# EAGLE design ESP12_2.9EPaper (EAGLE 9.1.3)
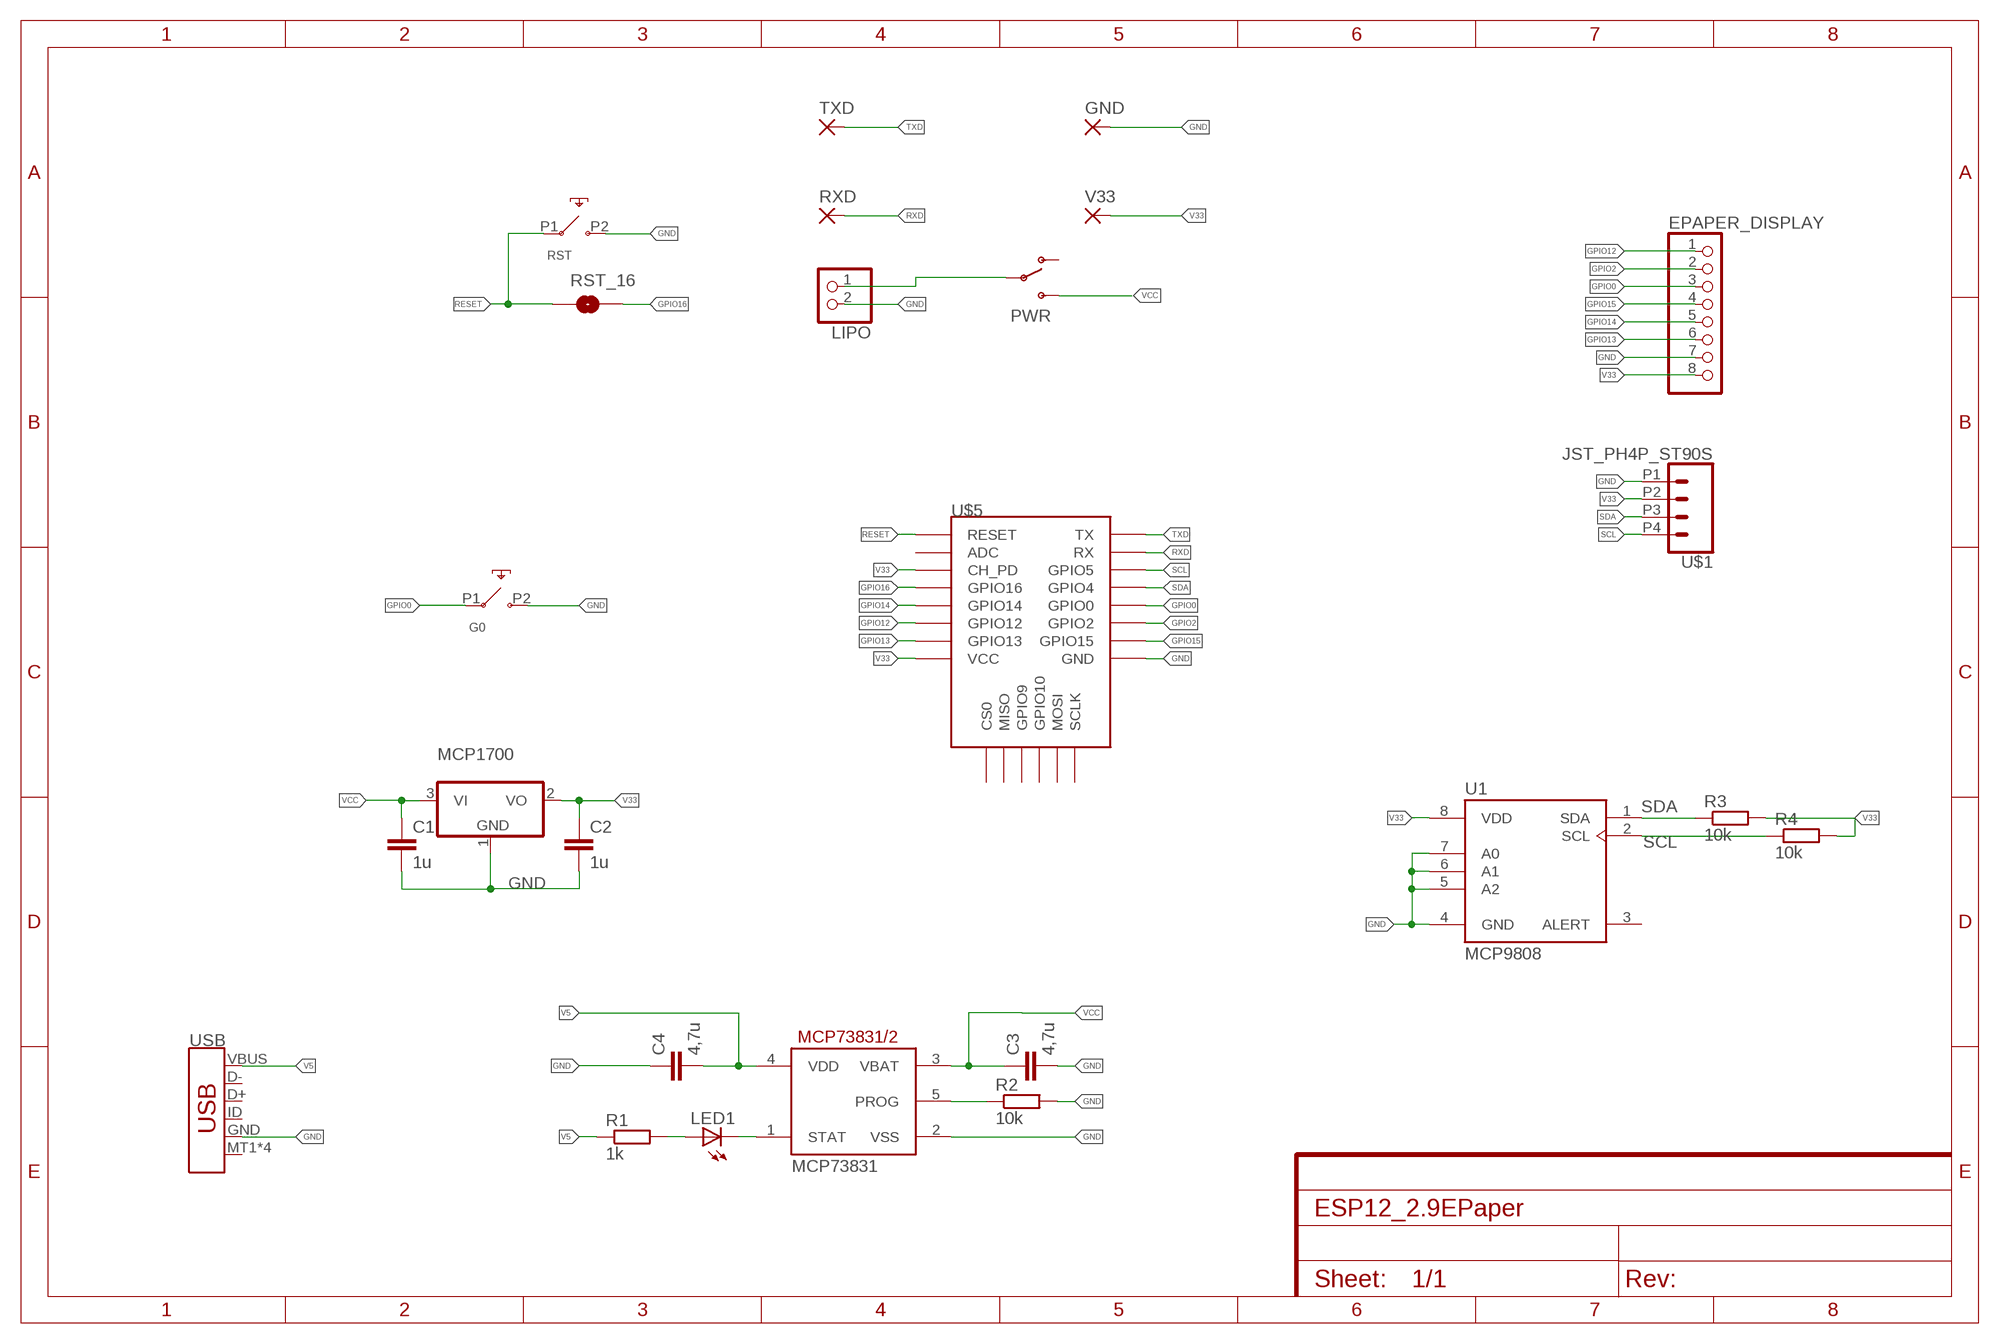
[diagram p0: schematic, sheet 1]

## Parts
C1  1u  C-EUC1206  [C1206]
C2  1u  C-EUC1206  [C1206]
C3  4,7u  C-EUC1206  [C1206]
C4  4,7u  C-EUC1206  [C1206]
EPAPER_DISPLAY  PINHD-1X8  [1X08]
G0  6X3_SMD_BUTTON_HALF  [6X3BUTTON]
GND  WIREPADSMD1,27-254  [SMD1,27-2,54]
LED1  LEDCHIPLED_1206  [CHIPLED_1206]
LIPO  JST_2PIN-SMT-RA  [JST-PH-2-SMT-RA]
MCP1700  MCP1703CB  [SOT23]
MCP73831  MCP73831/OT  [SOT23-5L]
PWR  SWITCH_SPDT  [KPS-1290]
R1  1k  R-EU_M1206  [M1206]
R2  10k  R-EU_M1206  [M1206]
R3  10k  R-EU_M1206  [M1206]
R4  10k  R-EU_M1206  [M1206]
RST  6X3_SMD_BUTTON_HALF  [6X3BUTTON]
RST_16  JUMPER-SMT_2_NO_NO-SILK  [SMT-JUMPER_2_NO_NO-SILK]
RXD  WIREPADSMD1,27-254  [SMD1,27-2,54]
TXD  WIREPADSMD1,27-254  [SMD1,27-2,54]
U1  MCP9808  MCP9808MSOP  [MSOP-8]
U$1  JST_PH4P_ST90S  [JST_PH4P_ST90S]
U$5  ESP8266-12F-SMD  [ESP8266-12F]
USB  USB_MICRO-B_SMT  [USB-MICROB]
V33  WIREPADSMD1,27-254  [SMD1,27-2,54]

## Nets
GND: C1.2 C2.2 C3.2 C4.1 EPAPER_DISPLAY.7 G0.P2 GND.1(P) LIPO.2 MCP1700.1(GND) MCP73831.2(VSS) R2.2 RST.P2 U1.4(GND) U1.5(A2) U1.6(A1) U1.7(A0) U$1.P1 U$5.GND USB.GND
GPIO0: EPAPER_DISPLAY.3 G0.P1 U$5.GPIO0
GPIO2: EPAPER_DISPLAY.2 U$5.GPIO2
GPIO12: EPAPER_DISPLAY.1 U$5.GPIO12
GPIO13: EPAPER_DISPLAY.6 U$5.GPIO13
GPIO14: EPAPER_DISPLAY.5 U$5.GPIO14
GPIO15: EPAPER_DISPLAY.4 U$5.GPIO15
GPIO16: RST_16.2 U$5.GPIO16
N$1: LIPO.1 PWR.P
N$2: MCP73831.5(PROG) R2.1
N$4: LED1.C MCP73831.1(STAT)
N$5: LED1.A R1.2
RESET: RST.P1 RST_16.1 U$5.RESET
RXD: RXD.1(P) U$5.RXD(RX)
SCL: R4.1 U1.2(SCL) U$1.P4 U$5.GPIO5
SDA: R3.1 U1.1(SDA) U$1.P3 U$5.GPIO4
TXD: TXD.1(P) U$5.TXD(TX)
V5: C4.2 MCP73831.4(VDD) R1.1 USB.VBUS
V33: C2.1 EPAPER_DISPLAY.8 MCP1700.2(VO) R3.2 R4.2 U1.8(VDD) U$1.P2 U$5.EN(CH_PD) U$5.VCC V33.1(P)
VCC: C1.1 C3.1 MCP1700.3(VI) MCP73831.3(VBAT) PWR.S
Unconnected: PWR.O U1.3(ALERT) U$5.ADC U$5.CS0 U$5.GPIO9 U$5.GPIO10 U$5.MISO U$5.MOSI U$5.SCLK USB.D+ USB.D- USB.ID USB.MT1(SHIELD) USB.MT2(SHIELD) USB.P$1(SHIELD) USB.P$2(SHIELD)

## Library data of the parts
C1-C4 = rcl:C-EU: CAPACITOR, European symbol; SPICEPREFIX: C
EPAPER_DISPLAY = pinhead:PINHD-1X8: PIN HEADER
G0 RST = moekoe:6X3_SMD_BUTTON_HALF
GND RXD TXD V33 = wirepad:WIREPAD: Wire PAD connect wire on PCB
LED1 = adafruit:LED: LED OSRAM: - CHIPLED LG R971, LG N971, LY N971, LG Q971, LY Q971, LO R971, LY R971 LH N974, LH R974 LS Q976, LO Q976, LY Q976 LO Q996 - Hyper CHIPLED LW Q18S LB Q993, LB Q99A, LB R99A - SideLED LS A670, LO A670, LY A670, LG A670, LP A670 LB A673, LV A673, LT A673, LW A673 LH A674 LY A675 LS A676, LA A676, LO A676, LY A676, LW A676 LS A679, LY A679, LG A679 - Hyper Micro SIDELED® LS Y876, LA Y876, LO Y876, LY Y876 LT Y87S - SmartLED LW L88C, LW L88S LB L89C, LB L89S, LG L890 LS L89K, LO L89K, LY L89K LS L896, LA L896, LO L896, LY L896 - TOPLED LS T670, LO T670, LY T670, LG T670, LP T670 LSG T670, LSP T670, LSY T670, LOP T670, LYG T670 LG T671, LOG T671, LSG T671 LB T673, LV T673, LT T673, LW T673 LH T674 LS T676, LA T676, LO T676, LY T676, LB T676, LH T676, LSB T676, LW T676 LB T67C, LV T67C, LT T67C, LS T67K, LO T67K, LY T67K, LW E67C LS E67B, LA E67B, LO E67B, LY E67B, LB E67C, LV E67C, LT E67C LW T67C LS T679, LY T679, LG T679 LS T770, LO T770, LY T770, LG T770, LP T770 LB T773, LV T773, LT T773, LW T773 LH T774 LS E675, LA E675, LY E675, LS T675 LS T776, LA T776, LO T776, LY T776, LB T776 LHGB T686 LT T68C, LB T68C - Hyper Mini TOPLED® LB M676 - Mini TOPLED Santana® LG M470 LS M47K, LO M47K, LY M47K Source: http://www.osram.convergy.de/
LIPO = adafruit:JST_2PIN: JST 2-Pin Connectors of various flavors SMT-RA (S2B-PH-SM4) 4UConnector #17311 SMT (B2B-PH-SM4) THM-RA (S2B-PH) THM (B2B-PH)
MCP1700 = linear:MCP1703: 250 mA, 16V, Low Quiescent Current LDO Regulator Source: http://ww1.microchip.com/downloads/en/DeviceDoc/22049b.pdf
MCP73831 = adafruit:MCP73831: MCP73831/2 Miniature Single-Cell, Fully Integrated Li-Ion, Li-Polymer Charge Management Controllers. Nice and small simple lipoly charge controller, with adjustable current and status output (LED) http://www.ladyada.net/library/pcb/eaglelibrary.html
PWR = SparkFun-Retired:SWITCH_SPDT: SWCH-10651 Side-actuated SPDT slide switch, as used on the Arduino Pro; PROD_ID: SWCH-10651
R1-R4 = rcl:R-EU_: RESISTOR, European symbol; SPICEPREFIX: R
RST_16 = SparkFun-Jumpers:JUMPER-SMT_2_NO: Normally open jumper This jumper has two pads in close proximity to each other. Apply solder to close the connection. Round pads are easier to solder for beginners, but are a lot larger. SparkFun Product that uses the round pads: SparkFun EL Sequencer <https://www.sparkfun.com/products/12781>
U1 = MCP9808:MCP9808; AVAILABILITY: Unavailable; DESCRIPTION: MCP9808 Series SMD 3.6 V Memory Module Digital Temperature Sensor - MSOP-8; MF: Microchip; MP: MCP9808-E/MS; PACKAGE: MSOP-8 Microchip; PRICE: None
U$1 = moekoe:JST_PH4P_ST90S
U$5 = moekoe:ESP8266-12F-SMD
USB = SparkFun-Connectors:USB_MICRO-B: USB Type Micro-B Connector Male/female and PTH/SMT variants SparkFun Products: SparkFun microB USB Breakout <https://www.sparkfun.com/products/12035> SparkFun USB microB Plug Breakout <https://www.sparkfun.com/products/10031> SparkFun ESP8266 Thing <https://www.sparkfun.com/products/13231>; PROD_ID: CONN-09505; SF_ID: PRT-08533

## Board
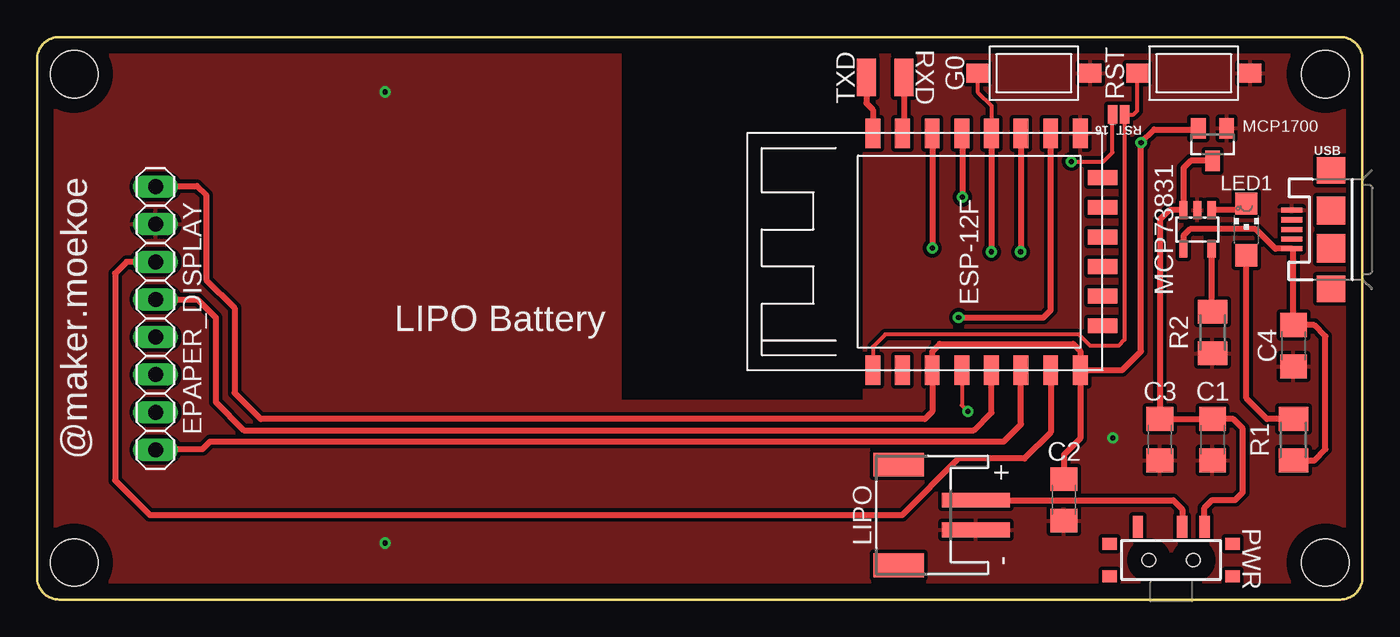
[diagram p1: board, top side]
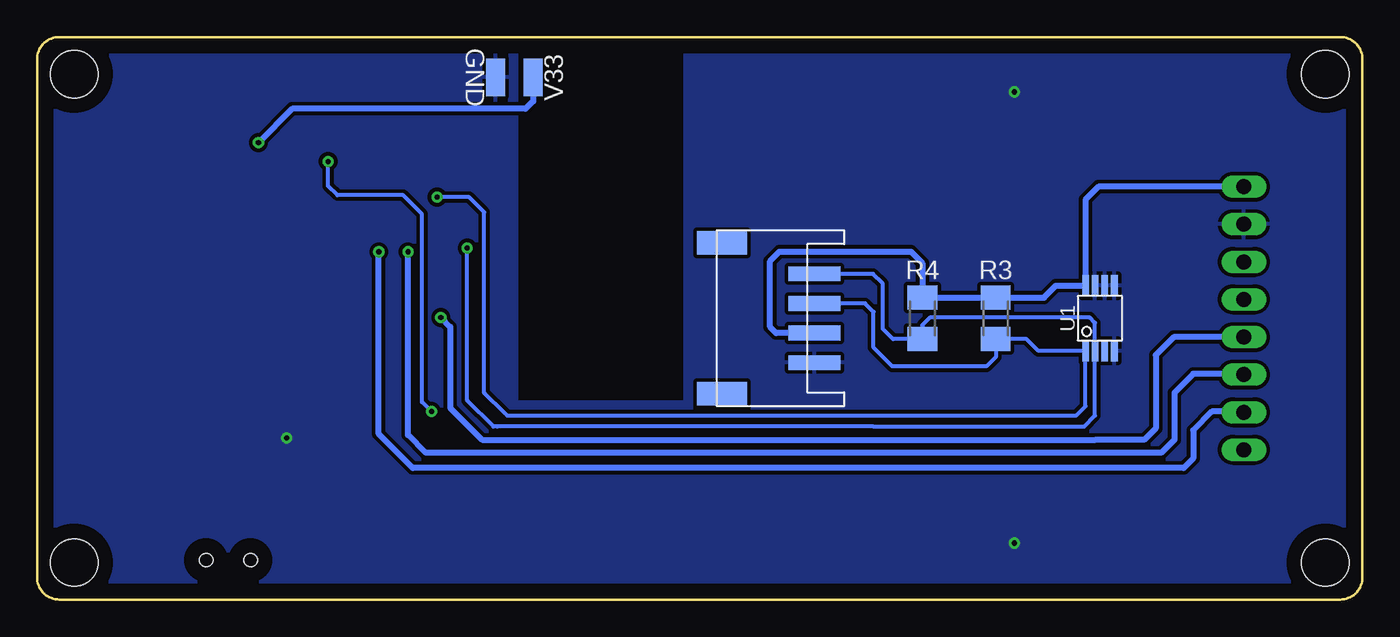
[diagram p2: board, bottom side, seen from below]

Size 89.5 x 38 mm. Coordinates in mm from the lower left corner, seen from the top.
Outline: 1.5,0 arc-90 0,1.5 0,36.5 arc-90 1.5,38 88,38 arc-90 89.5,36.5 89.5,1.5 arc-90 88,0 1.5,0
Copper layers (1*16): Top 0.035mm / dielectric 1.5mm / Bottom 0.035mm
Design rules "default": minimum track width 6mil, minimum drill 0.35mm, track to track 6mil, track to pad 6mil, pad to pad 6mil, via to via 6mil, smd to smd 6mil, copper to edge 40mil, drill to drill 6mil, minimum pad ring 10mil, minimum via ring 8mil, stop-mask expansion 4mil, vias tented up to drill 0mil, thermal gap 10mil
Holes 3.2 mm at 2.5,2.5 2.5,35.5 87,35.5 87,2.5

### Footprints (pad centres in the part's own frame; a part is rotated, then mirrored left to right if it is on the bottom)
C1206 = smd 1.6 x 1.8: 1 -1.4,0; 2 1.4,0
1X08 = drill 1.016 long: 1 -8.89,0; 2 -6.35,0; 3 -3.81,0; 4 -1.27,0; 5 1.27,0; 6 3.81,0; 7 6.35,0; 8 8.89,0
6X3BUTTON = smd 1.5 x 1.27: P1 -3.81,0; P2 3.81,0
SMD1,27-2,54 = smd 1.27 x 2.54: 1 0,0
CHIPLED_1206 = smd 1.5 x 1.5: A 0,-1.75; C 0,1.75
JST-PH-2-SMT-RA = smd 1 x 4.6: 1 1,-3.7; 2 -1,-3.7 | smd 1.6 x 3.4: NC1 -3.4,1.5; NC2 3.4,1.5
SOT23 = smd 1 x 1.4: 1 -0.95,-1.1; 2 0.95,-1.1; 3 0,1.1
SOT23-5L = smd 0.55 x 1.2: 1 -0.95,-1.3; 2 0,-1.3; 3 0.95,-1.3; 4 0.95,1.3; 5 -0.95,1.3
KPS-1290 = smd 0.7 x 1.5: O -2.25,2.25; P 0.75,2.25; S 2.25,2.25 | smd 1 x 0.8: P$1 -4.15,1.1; P$2 -4.15,-1.1; P$3 4.15,-1.1; P$4 4.15,1.1 | hole 0.9: -1.5,0; 1.5,0
M1206 = smd 1.6 x 2: 1 -1.4,0; 2 1.4,0
SMT-JUMPER_2_NO_NO-SILK = smd 0.635 x 1.27: 1 -0.406,0; 2 0.406,0
MSOP-8 = smd 1.45 x 0.45: 1 -2.2,0.975; 2 -2.2,0.325; 3 -2.2,-0.325; 4 -2.2,-0.975; 5 2.2,-0.975; 6 2.2,-0.325; 7 2.2,0.325; 8 2.2,0.975
JST_PH4P_ST90S = smd 1 x 3.5: P1 -3,0; P2 -1,0; P3 1,0; P4 3,0 | smd 1.6 x 3.4: P5 -5.1,6.25; P6 5.1,6.25
ESP8266-12F = smd 2 x 1: ADC -8,1.5; EN -8,-0.5; GND 8,-10.5; GPIO0 8,-4.5; GPIO2 8,-6.5; GPIO4 8,-2.5; GPIO5 8,-0.5; GPIO12 -8,-6.5; GPIO13 -8,-8.5; GPIO14 -8,-4.5; GPIO15 8,-8.5; GPIO16 -8,-2.5; RESET -8,3.5; RXD 8,1.5; TXD 8,3.5; VCC -8,-10.5 | smd 1 x 2: CS0 -5,-12; GPIO9 -1,-12; GPIO10 1,-12; MISO -3,-12; MOSI 3,-12; SCLK 5,-12
USB-MICROB = smd 1.4 x 0.35: D+ -2.65,0; D- -2.65,-0.65; GND -2.65,1.3; ID -2.65,0.65; VBUS -2.65,-1.3 | smd 1.9 x 1.8: MT1 0,-4; MT2 0,4 | smd 1.9 x 1.9: P$1 0,-1.27; P$2 0,1.27

### Placement (x,y rotation side)
C1  79.38,10.79 270 top
C2  69.34,6.73 270 top
C3  75.82,10.79 270 top
C4  84.84,17.14 90 top
EPAPER_DISPLAY  8,19 90 top
G0  67.31,35.56 0 top
GND  58.54,35.27 0 bottom
LED1  81.66,25 0 top
LIPO  59.69,5.71 90 top
MCP1700  79.38,30.73 180 top
MCP73831  78.36,25 180 top
PWR  76.58,2.67 0 top
R1  84.84,10.79 90 top
R2  79.38,18.03 270 top
R3  24.77,19 90 bottom
R4  29.71,19 90 bottom
RST  78.11,35.56 0 top
RST_16  73.03,32.77 180 top
RXD  58.54,35.27 180 top
TXD  56,35.27 0 top
U1  17.73,19 90 bottom
U$1  37,19 90 bottom
U$5  59.94,23.5 90 top
USB  87.38,25 0 top
V33  56,35.27 0 bottom

### Tracks (layer width: path | path; a pad name or v marks a point on that pad's centre or on a via)
GND  (via drill 0.35)
  other vias: 72.64,10.92 23.5,34.29 23.5,3.81
  pour Bottom (isolate 0.254): -1.27,39.37 -1.27,-1.91 91.44,-1.91 91.44,39.37 58.42,39.37 57.15,39.37 57.15,13.34 45.72,13.34 45.72,39.37
  pour Top (isolate 0.254): -1.27,39.37 -1.27,-2.54 91.44,-2.54 91.44,39.37 55.88,39.37 55.88,13.34 39.37,13.34 39.37,38.73 39.37,39.37
GPIO0  (via drill 0.35)
  Top 0.254: G0.P1 63.5,34.29 64.44,33.35 U$5.GPIO0
  Top 0.406: U$5.GPIO0 v64.44,23.5 v64.45,23.5
  Bottom 0.406: v64.45,23.5 64.45,11.11 63.25,9.91 13.59,9.91 12.7,10.79 12.7,13.97 11.43,15.24 8.05,15.24 EPAPER_DISPLAY.3
GPIO2  (via drill 0.35)
  Top 0.406: U$5.GPIO2 66.44,23.52 v66.42,23.5
  Bottom 0.406: v66.42,23.5 66.42,11.18 64.14,8.89 12.06,8.89 11.43,9.53 11.43,11.43 10.16,12.7 8.05,12.7 EPAPER_DISPLAY.2
GPIO12
  Top 0.406: EPAPER_DISPLAY.1 8.94,10.16 11.18,10.16 11.68,10.67 65.28,10.67 66.44,11.83 U$5.GPIO12
GPIO13
  Top 0.406: EPAPER_DISPLAY.6 6.05,22.81 5.27,22.04 5.27,8.06 7.62,5.71 58.42,5.71 62.23,9.53 66.67,9.53 68.44,11.29 U$5.GPIO13
GPIO14
  Top 0.406: EPAPER_DISPLAY.5 10.85,20.27 12.06,19.05 12.06,13.34 13.97,11.43 63.25,11.43 64.44,12.63 U$5.GPIO14
GPIO15  (via drill 0.35)
  Top 0.406: v62.23,19.05 67.94,19.05 68.44,19.55 U$5.GPIO15
  Bottom 0.406: EPAPER_DISPLAY.4 12.75,17.73 13.97,16.51 13.97,11.56 14.73,10.79 18.03,10.79 59.44,10.79 61.59,12.95 61.59,18.41 v62.23,19.05
GPIO16  (via drill 0.35)
  Top 0.254: U$5.GPIO16 62.44,13.12 v62.87,12.7 | v69.85,29.59 72.01,29.59 72.62,30.2 RST_16.2
  Bottom 0.254: v62.87,12.7 63.5,13.34 63.5,26.04 64.77,27.3 69.22,27.3 69.85,27.94 v69.85,29.59
N$1
  Top 0.406: LIPO.1 76.72,6.71 77.33,6.11 PWR.P
N$2
  Top 0.406: MCP73831.5 79.31,19.5 R2.1
N$4
  Top 0.406: LED1.C 81.21,26.3 MCP73831.1
N$5
  Top 0.406: R1.2 83.06,12.2 81.66,13.59 LED1.A
RESET
  Top 0.254: U$5.RESET 56.44,17.07 57.28,17.91 70.36,17.91 71.12,17.14 73.03,17.14 73.43,17.55 RST_16.1 74.04,32.77 74.3,33.02 RST.P1
RXD
  Top 0.406: RXD.1 58.54,31.59 U$5.RXD
SCL  (via drill 0.35)
  Top 0.406: U$5.GPIO5 v60.44,23.76 v60.45,23.75
  Bottom 0.254: 33.02,11.68 58.42,11.68 | 58.42,11.68 58.67,11.68 | 58.42,11.68 58.67,11.68 | 58.67,11.68 60.45,13.46 v60.45,23.75 | U$1.P4 33.05,22 32.38,21.34 32.38,18.29 31.7,17.6 R4.1 29.71,18.55 29.21,19.05 18.41,19.05 18.05,18.69 U1.2 18.05,12.43 18.8,11.68 33.02,11.68 | 33.02,11.68
SDA  (via drill 0.35)
  Top 0.406: U$5.GPIO4 62.48,31.45 v62.48,27.18
  Bottom 0.254: U$1.P3 33.59,20 33.02,19.43 33.02,17.02 31.75,15.75 25.4,15.75 24.77,16.38 R3.1 22.68,17.6 21.88,16.8 U1.1 18.7,13.04 19.3,12.45 57.78,12.45 57.91,12.57 59.31,13.97 59.31,26.16 60.33,27.18 v62.48,27.18
TXD
  Top 0.406: TXD.1 56,33.53 56.44,33.09 U$5.TXD
V5
  Top 0.406: MCP73831.4 77.41,24.58 77.85,25.02 82.3,25.02 83.61,23.7 USB.VBUS 84.84,23.59 C4.2 86.23,18.55 87,17.78 87,10.16 86.23,9.39 R1.1
V33  (via drill 0.35)
  Top 0.406: EPAPER_DISPLAY.8 8.94,27.94 10.79,27.94 11.43,27.3 11.43,21.59 13.34,19.68 13.34,13.97 15.11,12.19 59.94,12.19 60.44,12.69 U$5.EN 60.44,16.76 60.96,17.27 69.98,17.27 70.44,16.8 U$5.VCC | C2.1 69.34,9.78 70.44,10.88 U$5.VCC | MCP1700.2 78.34,31.75 75.44,31.75 v74.55,30.86 74.55,16.76 73.28,15.49 U$5.VCC
  Bottom 0.406: EPAPER_DISPLAY.8 17.83,27.89 18.7,27.02 U1.8 20.71,21.2 21.51,20.4 R3.2 R4.2 29.71,22.73 30.48,23.5 39.37,23.5 40.01,22.86 40.01,18.41 39.59,18 U$1.P2 | V33.1 56,33.66 56.52,33.15 72.26,33.15 v74.55,30.86
VCC
  Top 0.406: PWR.S 78.83,6.19 79.38,6.73 80.9,6.73 81.41,7.24 81.41,11.56 80.77,12.2 C1.1 C3.1 75.82,25.65 76.47,26.3 MCP73831.3 77.41,29.15 77.89,29.63 MCP1700.3

### Text on the board
tNames: @maker.moekoe | LIPO Battery